# Altium schematic sheet Bluetooth.SchDoc
size 209 x 148 mm
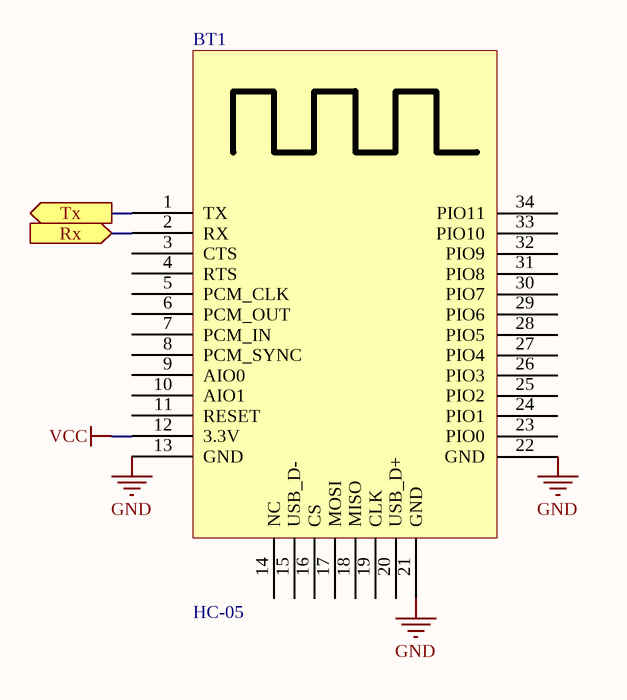
[diagram p0: Bluetooth.SchDoc]

## Parts
BT1  HC-05  [HC-05]

## Ports
Rx (in), Tx (out)

## Nets
GND: BT1.13(GND) BT1.21(GND) BT1.22(GND)
VCC: BT1.12(3.3V)
Rx: BT1.2(RX) ; port Rx
Tx: BT1.1(TX) ; port Tx

Not connected (* = marked no-connect by the designer): BT1 3(CTS) 4(RTS) 5(PCM_CLK) 6(PCM_OUT) 7(PCM_IN) 8(PCM_SYNC) 9(AIO0) 10(AIO1) 11(RESET) 14(NC) 15(USB_D-) 16(CS) 17(MOSI) 18(MISO) 19(CLK) 20(USB_D+) 23(PIO0) 24(PIO1) 25(PIO2) 26(PIO3) 27(PIO4) 28(PIO5) 29(PIO6) 30(PIO7) 31(PIO8) 32(PIO9) 33(PIO10) 34(PIO11)